# Altium project 1st_desing.PrjPcb (part 2 of 2)

## Sheet Power.SchDoc
size A4; SheetNumber: 5; SheetTotal: 9
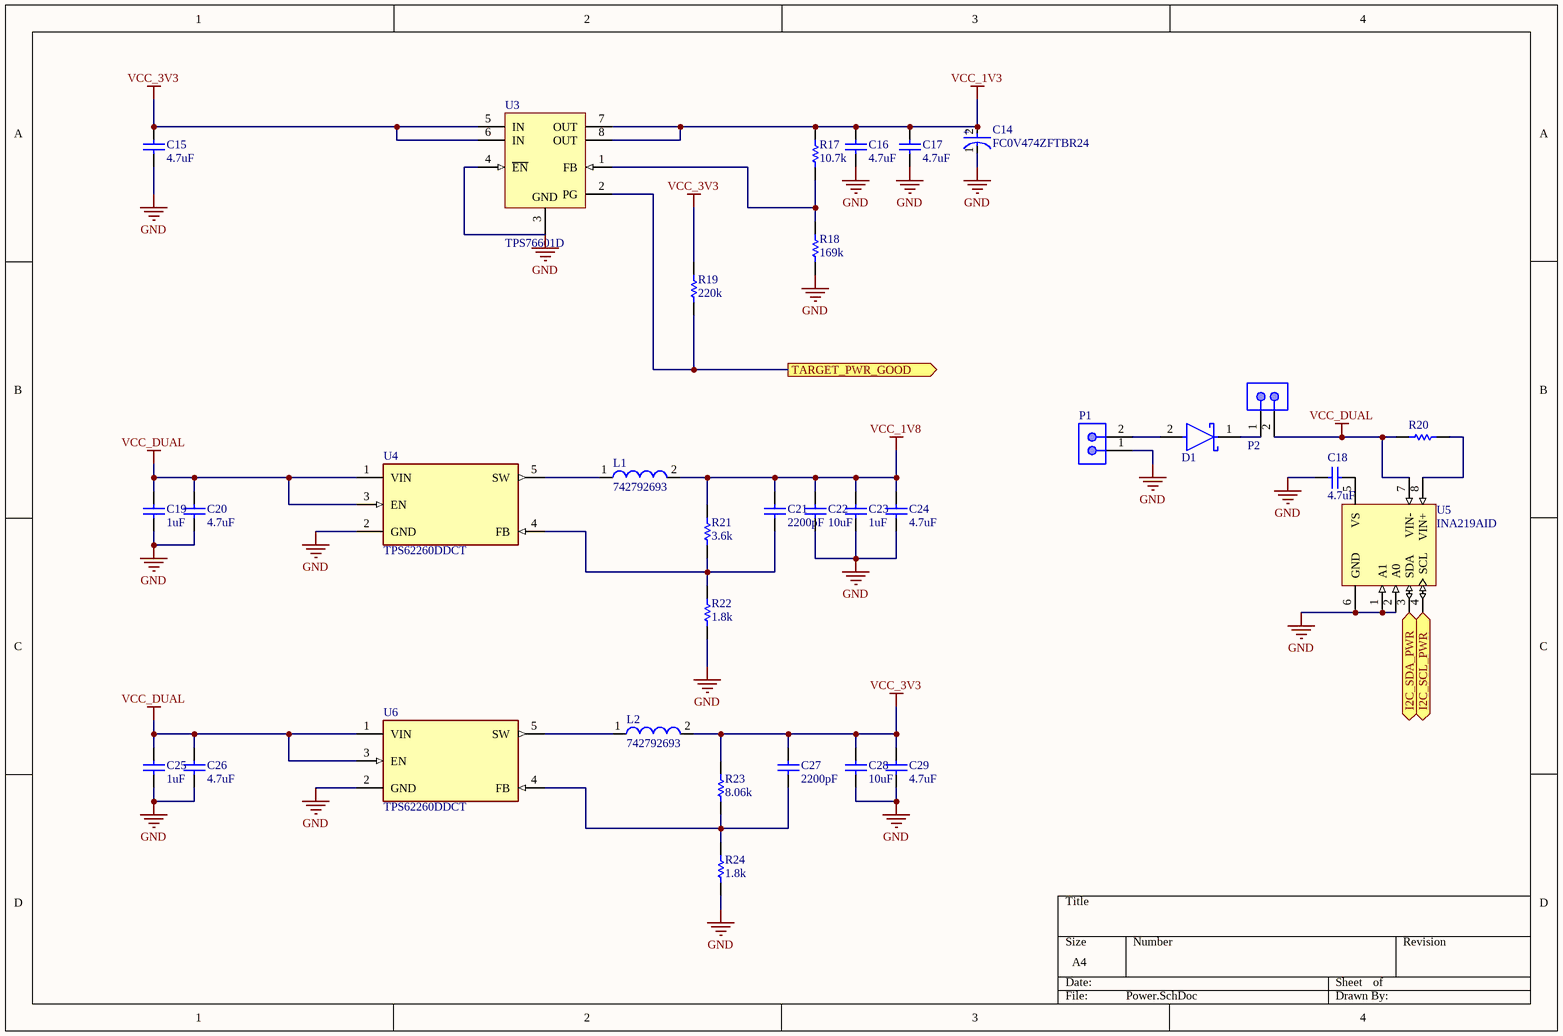
[diagram p8: Power.SchDoc]

### Parts
C14  FC0V474ZFTBR24  [FP-FC0V474ZFTBR24-MFG]
C15  4.7uF  [0805_C_S]
C16  4.7uF  [0805_C_S]
C17  4.7uF  [0805_C_S]
C18  4.7uF  [0805_C_S]
C19  1uF  [0805_C_S]
C20  4.7uF  [0805_C_S]
C21  2200pF  [0805_C_S]
C22  10uF  [0805_C_S]
C23  1uF  [0805_C_S]
C24  4.7uF  [0805_C_S]
C25  1uF  [0805_C_S]
C26  4.7uF  [0805_C_S]
C27  2200pF  [0805_C_S]
C28  10uF  [0805_C_S]
C29  4.7uF  [0805_C_S]
D1  MBR0520LT1G  [FP-425-04-IPC_C]  (value not drawn)
L1  742792693  [SMD-0603]
L2  742792693  [SMD-0603]
P1  22-23-2021  [MOLX-22-23-2021_V]  (value not drawn)
P2  22-23-2021  [MOLX-22-23-2021_V]  (value not drawn)
R17  10.7k  [0805_R_S]
R18  169k  [0805_R_S]
R19  220k  [0805_R_S]
R20  ERJ-6GEYJ1R0V  [RESC2013X70X40NL20T20]  (value not drawn)
R21  3.6k  [0805_R_S]
R22  1.8k  [0805_R_S]
R23  8.06k  [0805_R_S]
R24  1.8k  [0805_R_S]
U3  TPS76601D  [D0008A_N]
U4  TPS62260DDCT  [FP-DDC0005A-MFG]
U5  INA219AID  [D0008A_N]
U6  TPS62260DDCT  [FP-DDC0005A-MFG]

### Ports
I2C_SCL_PWR (bidir), I2C_SDA_PWR (bidir), TARGET_PWR_GOOD (out)

### Nets
GND: C14.1(C) C15.1 C16.1 C17.1 C18.2 C19.1 C20.1 C22.1 C23.1 C24.1 C25.1 C26.1 C28.1 C29.1 P1.1 R18.2 R22.2 R24.2 U3.4(~{EN}) U4.2(GND) U5.1(A1) U5.2(A0) U5.6(GND) U6.2(GND)
VCC_1V3: C14.2(A) C16.2 C17.2 R17.1 U3.7(OUT) U3.8(OUT)
VCC_1V8: C21.2 C22.2 C23.2 C24.2 L1.2 R21.1
VCC_3V3: C15.2 C27.2 C28.2 C29.2 L2.2 R19.1 R23.1 U3.5(IN) U3.6(IN)
VCC_DUAL: C19.2 C20.2 C25.2 C26.2 P2.2 R20.1 U4.1(VIN) U4.3(EN) U5.7(VIN-) U6.1(VIN) U6.3(EN)
I2C_SCL: U5.4(SCL) ; port I2C_SCL_PWR
I2C_SDA: U5.3(SDA) ; port I2C_SDA_PWR
PWR_GOOD: R19.2 U3.2(PG) ; port TARGET_PWR_GOOD
NetC18_1: C18.1 U5.5(VS)
NetC21_1: C21.1 R21.2 R22.1 U4.4(FB)
NetC27_1: C27.1 R23.2 R24.1 U6.4(FB)
NetD1_1: D1.1(C) P2.1
NetD1_2: D1.2(A) P1.2
NetL1_1: L1.1 U4.5(SW)
NetL2_1: L2.1 U6.5(SW)
NetR17_2: R17.2 R18.1 U3.1(FB)
NetR20_2: R20.2 U5.8(VIN+)

Not connected (* = marked no-connect by the designer): U3 3(GND)

### Notes on the sheet
- (in symbol CMP-03024-000007-1) +

### Library data of the parts
C14 = CMP-03024-000007-1: CAP 470MF -20% +80% 3.5V SMD; ESR (Equivalent Series Resistance): 25R; Leakage Current: 420uA; Tolerance: 80%; Package Quantity: 500; Height: 8.5mm; Diameter: 10.5mm; Radiation Hardening: No; Voltage Rating (DC): 3.5V; Min Operating Temperature: -25°C; Length: 10.8mm; Depth: 8.5mm; Voltage Rating: 3.5V; REACH SVHC: No SVHC; RoHS Compliant: Yes; Capacitance: 470mF; Mount: Surface Mount; Contact Plating: Tin; Width: 10.8mm; Voltage: 3.5V; Lead Pitch: 5mm; Height - Seated (Max): 0.335inch; Termination: SMD/SMT; Case/Package: Radial; Max Operating Temperature: 70°C; Packaging: Tape and Reel
C15-C29 = Cap: Capacitor; Published: 8-Jun-2000; LatestRevisionDate: 17-Jul-2002; LatestRevisionNote: Re-released for DXP Platform.; Publisher: Altium Limited
  C15-C18 C20 C24 C26 C29: Value: 4.7uF
  C19 C23 C25: Value: 1uF
  C21 C27: Value: 2200pF
  C22 C28: Value: 10uF
D1 = CMP-1055-00425-2: DIODE SCHOTTKY 20V 500MA SOD123; Polarity: Standard; Peak Non-Repetitive Surge Current: 5.5A; Forward Voltage: 385mV; Element Configuration: Single; Peak Reverse Current: 250uA; Max Repetitive Reverse Voltage (Vrrm): 20V; Voltage Rating (DC): 20V; Case/Package: SOD-123-2; Number of Pins: 2; Output Current: 500mA; Min Operating Temperature: -65°C; Lead Free: Lead Free; REACH SVHC: No SVHC; Max Reverse Voltage (DC): 20V; Termination: SMD/SMT; Average Rectified Current: 500mA; Max Surge Current: 5.5A; Package Quantity: 3000; Height: 1.12mm; Current Rating: 500mA; Forward Current: 500mA; Max Forward Surge Current (Ifsm): 5.5A; Packaging: Tape and Reel; Length: 2.69mm; Radiation Hardening: No; Max Reverse Leakage Current: 250uA; Width: 1.6mm; Contact Plating: Tin; Max Operating Temperature: 125°C
L1 L2 = CMP-0220-00111-1: SMD EMI Suppression Ferrite Bead WE-CBF, Z = 2200 Ohm; PackageDescription: Chip Inductor, 2-Leads, Body 1.6 x 0.8 mm; ComponentLink1URL: http://www.we-online.com; ComponentLink1Description: Manufacturer Link; DatasheetVersion: Dec-2005; PackageVersion: 2009; ComponentLink2URL: http://www.we-online.de/katalog/media/pdf/742792693.pdf; PackageReference: SMD-0603; Impedance: 2200 Ohm; ComponentLink2Description: Datasheet
P1 P2 = CMP-1704-00001-3: Male Header, Pitch 2.54 mm, 1 x 2 Position, Height 10.67 mm, Tail Length 3.56 mm, 0 to 75 degC, RoHS, Bulk; Package Quantity: 3000; Height: 10.67 mm; RoHSCompliant: True; ComponentLink2URL: https://datasheet.ciiva.com/19454/232266-19454304.pdf; PartNumber: 22-23-2021; Packaging: Bulk; ComponentLink2Description: Datasheet; Min Operating Temperature: 0 degC; ComponentLink1Description: Manufacturer URL; Length: 5.08 mm; Mounting Technology: Through Hole; Max Operating Temperature: 75 degC; REACH SVHC: Unknown; PackageDescription: Male Header, Pitch 2.54 mm, 1 x 2 Position, Height 10.67 mm, Tail Length 3.56 mm; ComponentLink1URL: http://www.molex.com/; Mount: Through Hole; Radiation Hardening: No; Width: 6.35 mm; Pins: 2
R17-R19 R21-R24 = Res1: Resistor; Published: 8-Jun-2000; LatestRevisionDate: 17-Jul-2002; LatestRevisionNote: Re-released for DXP Platform.; Publisher: Altium Limited
  R17: Value: 10.7k
  R18: Value: 169k
  R19: Value: 220k
  R21: Value: 3.6k
  R22 R24: Value: 1.8k
  R23: Value: 8.06k
R20 = CMP-1013-00002-2: Manufacturer: Panasonic; Part Number: ERJ-6GEYJ1R0V
U3 = CMP-0394-00011-2: Single Output LDO, 250 mA, Adjustable 1.25 to 5.5 V Output, 2.7 to 10 V Input, with Low IQ, 8-pin SOIC (D), -40 to 125 degC, Green (RoHS & no Sb/Br); Manufacturer: Texas Instruments; Vin(Max)(V): 10; SubFamily: Single Channel LDO; Vin(Min)(V): 2.7; Iout(Max)(A): 0.25; Vout Adj(Max)(V): 5.5; Vout Adj(Min)(V): 1.25; Iq(Typ)(mA): 0.03; Vdo(Typ)(mV): 140; Rating: Catalog; Power Good: TRUE; Mounting Technology: Surface Mount; Code_JEDEC: MS-012; PackageVersion: 4040047-3/M; PackageReference: D0008A; ComponentLink2Description: Datasheet; PartNumber: TPS76601D; ComponentLink3URL: http://www.ti.com/litv/pdf/msoi002j; ComponentLink2URL: http://www.ti.com/general/docs/lit/getliterature.tsp?genericPartNumber=TPS76601&fileType=pdf; DatasheetVersion: SLVS237C; PackageDescription: 8-Pin Plastic Small Outline, Body 4.9 x 3.9 mm, Pitch 1.27 mm; ComponentLink3Description: Package Specification; ComponentLink1Description: Manufacturer URL; Eco-Plan: Green (RoHS & no Sb/Br); ComponentLink1URL: http://www.ti.com/
U4 U6 = CMP-04918-000295-1: IC REG BUCK ADJ 600MA SOT23-5; Operating Supply Voltage: 6V; Output Type: Adjustable; Min Output Voltage: 600mV; Nominal Supply Current: 15uA; Synchronous Rectifier: Yes; Output Configuration: Positive; Switching Frequency: 2.5MHz; Number of Outputs: 1; Min Input Voltage: 2V; Case/Package: SOT; Width: 3.05mm; Max Operating Temperature: 85°C; Output Current: 600mA; Max Output Current: 600mA; RoHS Compliant: Yes; Max Output Voltage: 6V; Packaging: Tape and Reel; Package Quantity: 250; Lead Free: Lead Free; Max Input Voltage: 6V; Min Operating Temperature: -40°C; REACH SVHC: No SVHC; Contact Plating: Gold; Quiescent Current: 15uA; Length: 3.05mm; Height: 1mm; Series: TPS62260; Number of Pins: 5; Radiation Hardening: No; Output Voltage: 6V; Mount: Surface Mount
U5 = CMP-0704-00006-2: Zero-Drift, Bi-Directional Current / Power Monitor, 3 to 5.5 V, -40 to 125 degC, 8-pin SOIC (D8), Green (RoHS & no Sb/Br); Manufacturer: Texas Instruments; Vs(Max)(V): 5.5; Rating: Catalog; Gain(V/V): 1, 0.5, 0.25, 0.125; Vs(Min)(V): 3; Common Mode Range(Max)(V): 26; Input Offset (+/-)(Max)(uV): 100; Small-Signal Bandwidth(Typ)(MHz): 0.011; SubFamily: Current Shunt Monitor; Common Mode Range(Min)(V): 0; Quiescent Current (+/-)(Typ)(mA): 0.7; PartNumber: INA219AID; ComponentLink2Description: Datasheet; PackageVersion: 4040047-3/M, 06/2011; ComponentLink3Description: Package Specification; Mounting Technology: Surface Mount; ComponentLink2URL: http://www.ti.com/general/docs/lit/getliterature.tsp?genericPartNumber=INA219&fileType=pdf; Eco-Plan: Green (RoHS & no Sb/Br); DatasheetVersion: SBOS448F; Code_JEDEC: MS-012; PackageDescription: 8-Pin Plastic Small Outline, Body 4.9 x 3.9 mm, Pitch 1.27 mm; ComponentLink1Description: Manufacturer URL; ComponentLink1URL: http://www.ti.com/; PackageReference: D0008A; ComponentLink3URL: http://www.ti.com/lit/ml/msoi002j/msoi002j.pdf; CMRR(Min)(dB): 100

## Nets that join several sheets
GND: Codec (10 pins), SPI_Flash (C11.1 U2.10), U_uSD_Card (C12_U_uSD_Card#1.1 C13_U_uSD_Card#1.1 SD1_U_uSD_Card#1.6 SD1_U_uSD_Card#1.10), clock_12MHz (C84.1 Y2.2), dsp_connection (11 pins), XDS100_V2 (37 pins), dsp_power (63 pins), U_uSD_Card (C12_U_uSD_Card#2.1 C13_U_uSD_Card#2.1 SD1_U_uSD_Card#2.6 SD1_U_uSD_Card#2.10), Power (24 pins)
GND_AIC: SAMARUC (J2.2 J3.2 P3.2 P4.2), Codec (8 pins)
VCC_1V3: dsp_connection (C38.2 C39.2 IC1.B4 IC1.B5), Power (6 pins)
VCC_1V8: dsp_power (6 pins), Power (6 pins)
VCC_3V3: Codec (7 pins), SPI_Flash (C11.2 R9.1 R10.1 U2.2), U_uSD_Card (9 pins), clock_12MHz (C84.2 Y2.1 Y2.4), dsp_connection (9 pins), XDS100_V2 (22 pins), dsp_power (10 pins), U_uSD_Card (9 pins), Power (9 pins)
VCC_DUAL: XDS100_V2 (D3.1 D4.2), Power (11 pins)
CLK_12MHz: Codec (R8.2 U1.1), clock_12MHz (Y2.3), dsp_connection (IC1.C1 IC1.E14), XDS100_V2 (U7.2)
I2C_SCL: Codec (R2.1 U1.9), dsp_connection (IC1.C4 R31.2), Power (U5.4)
I2C_SDA: Codec (R3.1 U1.10), dsp_connection (IC1.A4 R32.2), Power (U5.3)
NetC5_2: SAMARUC (C30.2), Codec (C5.2 R4.2)
NetC6_2: SAMARUC (C31.2), Codec (C6.2 R5.1)
NetIC1_A3: SAMARUC (J1.1), dsp_connection (IC1.A3)
NetIC1_J1: dsp_connection (IC1.J1), U_uSD_Card (R14_U_uSD_Card#2.2 SD1_U_uSD_Card#2.7)
NetIC1_K1: SPI_Flash (U2.15), dsp_connection (IC1.K1)
NetIC1_K2: dsp_connection (IC1.K2), XDS100_V2 (R38.2)
NetIC1_L1: SPI_Flash (U2.7), dsp_connection (IC1.L1)
NetIC1_L3: SPI_Flash (U2.16), dsp_connection (IC1.L3)
NetIC1_L11: U_uSD_Card (R13_U_uSD_Card#1.2 SD1_U_uSD_Card#1.3), dsp_connection (IC1.L11)
NetIC1_L12: U_uSD_Card (R12_U_uSD_Card#1.2 SD1_U_uSD_Card#1.2), dsp_connection (IC1.L12)
NetIC1_M8: dsp_connection (IC1.M8), U_uSD_Card (SD1_U_uSD_Card#2.5)
NetIC1_M10: dsp_connection (IC1.M10), U_uSD_Card (R13_U_uSD_Card#2.2 SD1_U_uSD_Card#2.3)
NetIC1_M11: dsp_connection (IC1.M11), XDS100_V2 (U7.39)
NetIC1_M12: U_uSD_Card (R11_U_uSD_Card#1.2 SD1_U_uSD_Card#1.1), dsp_connection (IC1.M12)
NetIC1_M13: U_uSD_Card (R14_U_uSD_Card#1.2 SD1_U_uSD_Card#1.7), dsp_connection (IC1.M13)
NetIC1_M14: U_uSD_Card (SD1_U_uSD_Card#1.5), dsp_connection (IC1.M14)
NetIC1_N1: dsp_connection (IC1.N1), XDS100_V2 (R39.2)
NetIC1_N3: dsp_connection (IC1.N3), XDS100_V2 (R36.2 R42.2)
NetIC1_N4: SPI_Flash (U2.8), dsp_connection (IC1.N4)
NetIC1_N6: dsp_connection (IC1.N6), XDS100_V2 (R40.2)
NetIC1_N10: Codec (U1.3), dsp_connection (IC1.N10)
NetIC1_N12: dsp_connection (IC1.N12), XDS100_V2 (U7.41)
NetIC1_N13: dsp_connection (IC1.N13), U_uSD_Card (R11_U_uSD_Card#2.2 SD1_U_uSD_Card#2.1)
NetIC1_P4: dsp_connection (IC1.P4), XDS100_V2 (R41.2 R43.1)
NetIC1_P5: Codec (U1.2), dsp_connection (IC1.P5)
NetIC1_P6: dsp_connection (IC1.P6), U_uSD_Card (R15_U_uSD_Card#2.2 SD1_U_uSD_Card#2.8)
NetIC1_P7: dsp_connection (IC1.P7), U_uSD_Card (R12_U_uSD_Card#2.2 SD1_U_uSD_Card#2.2)
NetIC1_P9: Codec (U1.5), dsp_connection (IC1.P9)
NetIC1_P10: U_uSD_Card (R15_U_uSD_Card#1.2 SD1_U_uSD_Card#1.8), dsp_connection (IC1.P10)
NetIC1_P11: Codec (U1.4), dsp_connection (IC1.P11)
NetIC1_P12: dsp_connection (IC1.P12), XDS100_V2 (U7.40)
NetIC1_P13: dsp_connection (IC1.P13), XDS100_V2 (U7.38)
PWR_GOOD: Codec (R6.2 U1.31), dsp_connection (IC1.D2), XDS100_V2 (R45.2 U8.6), Power (R19.2 U3.2)